# Altium schematic sheet PFC control board.SchDoc
size B; Organization: Altium Limited; Address1: L3, 12a Rodborough Rd; Address2: Frenchs Forest; Address3: NSW; Address4: Australia 2086; SheetNumber: 1; SheetTotal: 1
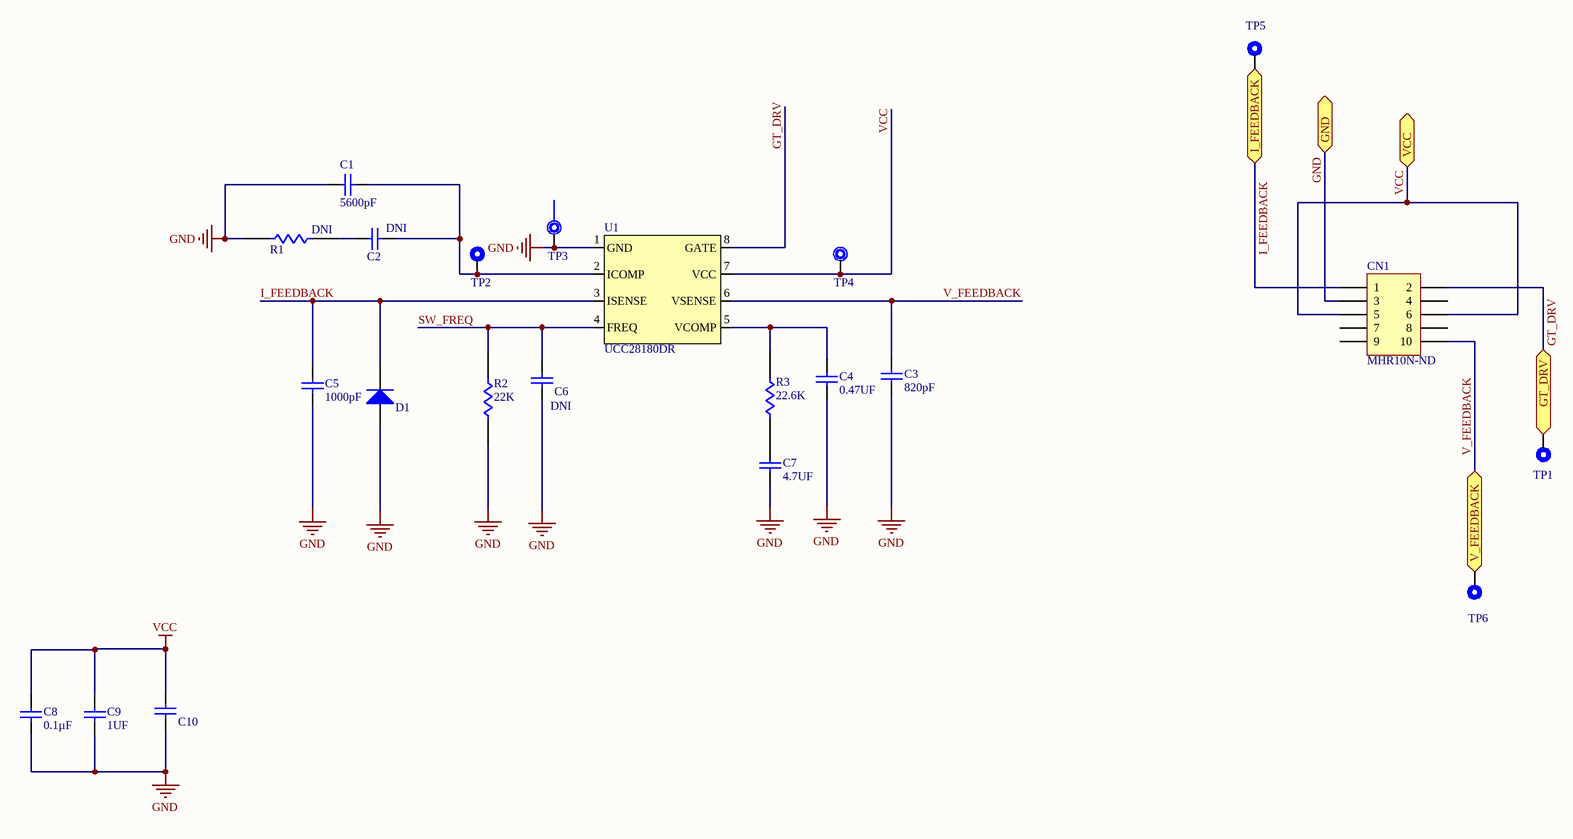
[diagram p0: PFC control board.SchDoc]

## Parts
C1  Capacitance: 5600pF  [CAP0805_NEW]  (hidden comment: GRM2195C1H562FA01D)
C2  C0805_Generic  [CAP0805_NEW]  (value not drawn)
C3  Capacitance: 820pF  [CAP0805_NEW]  (hidden comment: CC0805KRX7R9BB821)
C4  Capacitance: 0.47UF  [CAP0805_NEW]  (hidden comment: C0805C474J5RACTU)
C5  Capacitance: 1000pF  [CAP0805_NEW]  (hidden comment: C0805C102J5GACTU)
C6  C0805_Generic  [CAP0805_NEW]  (value not drawn)
C7  Capacitance: 4.7UF  [CAP0805_NEW]  (hidden comment: GRM21BR61H475KE51L)
C8  Capacitance: 0.1µF  [CAP0805_NEW]  (hidden comment: C0805C104J5RACAUTO)
C9  Capacitance: 1UF  [CAP0805_NEW]  (hidden comment: CC0805JKX7R9BB105)
C10  C0805_Generic  [CAP0805_NEW]  (value not drawn)
CN1  MHR10N-ND  [3M15452]
D1  MRA4004T3G  [MRA4004T3G]  (value not drawn)
R1  R0805_Generic  [RES0805_New]  (value not drawn)
R2  value 22K  [RES0805_New]  (hidden comment: RC0805FR-0722KL)
R3  value 22.6K  [RES0805_New]  (hidden comment: RC0805FR-0722K6L)
TP1  5006  [Test Point]  (value not drawn)
TP2  5006  [Test Point]  (value not drawn)
TP3  TP-Slot  [TP-Slot]  (value not drawn)
TP4  TP-SM  [TP-SM]  (value not drawn)
TP5  5006  [Test Point]  (value not drawn)
TP6  5006  [Test Point]  (value not drawn)
U1  UCC28180DR  [SOP127P600X175-8N]

## Ports
GND, GT_DRV, I_FEEDBACK, V_FEEDBACK, VCC

## Nets
GND: C1.1 C3.1 C4.1 C5.1 C6.1 C7.1 C8.1 C9.1 C10.1 CN1.3 D1.1 R1.2 R2.2 TP3.1 U1.1(GND) ; port GND
VCC: C8.2 C9.2 C10.2 CN1.5 CN1.6 TP4.1 U1.7(VCC) ; port VCC
GT_DRV: CN1.2 TP1.1 U1.8(GATE) ; port GT_DRV
I_FEEDBACK: C5.2 CN1.1 D1.2 TP5.1 U1.3(ISENSE) ; port I_FEEDBACK
SW_FREQ: C6.2 R2.1 U1.4(FREQ)
V_FEEDBACK: C3.2 CN1.10 TP6.1 U1.6(VSENSE) ; port V_FEEDBACK
NetC1_2: C1.2 C2.2 TP2.1 U1.2(ICOMP)
NetC2_1: C2.1 R1.1
NetC4_2: C4.2 R3.1 U1.5(VCOMP)
NetC7_2: C7.2 R3.2

Not connected (* = marked no-connect by the designer): CN1 4 7 8 9

## Notes on the sheet
- (near R1) DNI
- (near C2) DNI
- (near C6) DNI
- Title:
- Size:
- B
- Document Number:
- Revision:
- Designer:
- Approval Date:
- Start Date:
- MM/DD/YY
- --/--/--
- Sheet:
- of
- Approver:
- CONFIDENTIAL
- Project Name/Number:

## Library data of the parts
C1 = GRM2195C1H562FA01D: CAP CER 5600PF 50V C0G/NP0 0805; Manufacturer: Murata Electronics North America; Tolerance: ±1%; Temperature Coefficient: C0G, NP0; Supplier 1: Digi-Key; Manufacturer Part Number: GRM2195C1H562FA01D; RoHS: RoHS Compliant; Category: Capacitors; Stock 1: 17402; Pricing 1: 1=0.46, 10=0.323, 100=0.2124, 500=0.15736, 1000=0.13376 (USD); Packaging: Cut Tape (CT); Part Status: Active; Voltage - Rated: 50V; Operating Temperature: -55°C ~ 125°C; Features: -; Ratings: -; Applications: General Purpose; Mounting Type: Surface Mount, MLCC; Package / Case: 0805 (2012 Metric); Size / Dimension: 0.079" L x 0.049" W (2.00mm x 1.25mm); Height - Seated (Max): -; Thickness (Max): 0.037" (0.95mm); Lead Spacing: -; Lead Style: -; ComponentLink1URL: http://www.murata.com/~/media/webrenewal/support/library/catalog/products/capacitor/mlcc/c02e.pdf; ComponentLink1Description: http://www.murata.com/~/media/webrenewal/support/library/catalog/products/capacitor/mlcc/c02e.pdf; Supplier Part Number 1: 490-8299-1-ND
C3 = CC0805KRX7R9BB821: CAP CER 820PF 50V X7R 0805; Manufacturer: Yageo; Tolerance: ±10%; Supplier 1: Digi-Key; Manufacturer Part Number: CC0805KRX7R9BB821; RoHS: RoHS Compliant; Category: Capacitors; Stock 1: 41011; Pricing 1: 1=0.11, 10=0.077, 100=0.0344, 500=0.0246, 1000=0.01932 (USD); Packaging: Cut Tape (CT); Part Status: Active; Voltage - Rated: 50V; Temperature Coefficient: X7R; Operating Temperature: -55°C ~ 125°C; Features: High Voltage; Ratings: -; Applications: General Purpose; Failure Rate: -; Mounting Type: Surface Mount, MLCC; Package / Case: 0805 (2012 Metric); Size / Dimension: 0.079" L x 0.049" W (2.00mm x 1.25mm); Height - Seated (Max): -; Thickness (Max): 0.024" (0.60mm); Lead Spacing: -; Lead Style: -; ComponentLink1URL: http://www.yageo.com/documents/recent/UPY-GPHC_X7R_6.3V-to-50V_18.pdf; ComponentLink1Description: http://www.yageo.com/documents/recent/UPY-GPHC_X7R_6.3V-to-50V_18.pdf; Supplier Part Number 1: 311-1194-1-ND
C4 = C0805C474J5RACTU: CAP CER 0.47UF 50V X7R 0805; Manufacturer: KEMET; Tolerance: ±5%; Supplier 1: Digi-Key; Manufacturer Part Number: C0805C474J5RACTU; RoHS: RoHS Compliant; Category: Capacitors; Stock 1: 10142; Pricing 1: 1=0.87, 10=0.642, 100=0.4402, 500=0.3485, 1000=0.29348 (USD); Packaging: Cut Tape (CT); Part Status: Active; Voltage - Rated: 50V; Temperature Coefficient: X7R; Operating Temperature: -55°C ~ 125°C; Features: Low ESL; Ratings: -; Applications: General Purpose; Failure Rate: -; Mounting Type: Surface Mount, MLCC; Package / Case: 0805 (2012 Metric); Size / Dimension: 0.079" L x 0.049" W (2.00mm x 1.25mm); Height - Seated (Max): -; Thickness (Max): 0.043" (1.10mm); Lead Spacing: -; Lead Style: -; ComponentLink1URL: http://www.kemet.com/docfinder?Partnumber=C0805C474J5RACTU; ComponentLink1Description: http://www.kemet.com/docfinder?Partnumber=C0805C474J5RACTU; Supplier Part Number 1: 399-11174-1-ND
C5 = C0805C102J5GACTU: CAP CER 1000PF 50V C0G/NP0 0805; Manufacturer: KEMET; Tolerance: ±5%; Temperature Coefficient: C0G, NP0; Supplier 1: Digi-Key; Manufacturer Part Number: C0805C102J5GACTU; RoHS: RoHS Compliant; Category: Capacitors; Stock 1: 297579; Pricing 1: 1=0.12, 10=0.09, 100=0.0403, 500=0.02876, 1000=0.0226 (USD); Packaging: Cut Tape (CT); Part Status: Active; Voltage - Rated: 50V; Operating Temperature: -55°C ~ 125°C; Features: Low ESL; Ratings: -; Applications: General Purpose; Failure Rate: -; Mounting Type: Surface Mount, MLCC; Package / Case: 0805 (2012 Metric); Size / Dimension: 0.079" L x 0.049" W (2.00mm x 1.25mm); Height - Seated (Max): -; Thickness (Max): 0.035" (0.88mm); Lead Spacing: -; Lead Style: -; ComponentLink1URL: http://www.kemet.com/docfinder?Partnumber=C0805C102J5GACTU; ComponentLink1Description: http://www.kemet.com/docfinder?Partnumber=C0805C102J5GACTU; Supplier Part Number 1: 399-1136-1-ND
C7 = GRM21BR61H475KE51L: CAP CER 4.7UF 50V X5R 0805; Manufacturer: Murata Electronics North America; Tolerance: ±10%; Supplier 1: Digi-Key; Manufacturer Part Number: GRM21BR61H475KE51L; RoHS: RoHS Compliant; Category: Capacitors; Stock 1: 103228; Pricing 1: 1=0.35, 10=0.242, 100=0.145, 500=0.10872, 1000=0.09181 (USD); Packaging: Cut Tape (CT); Part Status: Active; Voltage - Rated: 50V; Temperature Coefficient: X5R; Operating Temperature: -55°C ~ 85°C; Features: -; Ratings: -; Applications: General Purpose; Mounting Type: Surface Mount, MLCC; Package / Case: 0805 (2012 Metric); Size / Dimension: 0.079" L x 0.049" W (2.00mm x 1.25mm); Height - Seated (Max): -; Thickness (Max): 0.055" (1.40mm); Lead Spacing: -; Lead Style: -; ComponentLink1URL: http://search.murata.co.jp/Ceramy/image/img/A01X/G101/ENG/GRM21BR61H475KE51-01.pdf; ComponentLink1Description: http://search.murata.co.jp/Ceramy/image/img/A01X/G101/ENG/GRM21BR61H475KE51-01.pdf; Supplier Part Number 1: 490-10751-1-ND
C8 = C0805C104J5RACAUTO: CAP CER 0.1UF 50V X7R 0805; Manufacturer: KEMET; Tolerance: ±5%; Supplier 1: Digi-Key; Manufacturer Part Number: C0805C104J5RACAUTO; RoHS: RoHS Compliant; Category: Capacitors; Stock 1: 8605; Pricing 1: 1=0.22, 10=0.152, 100=0.0769, 500=0.05262, 1000=0.04655 (USD); Packaging: Cut Tape (CT); Part Status: Active; Voltage - Rated: 50V; Temperature Coefficient: X7R; Operating Temperature: -55°C ~ 125°C; Features: -; Ratings: AEC-Q200; Applications: Automotive; Failure Rate: -; Mounting Type: Surface Mount, MLCC; Package / Case: 0805 (2012 Metric); Size / Dimension: 0.079" L x 0.049" W (2.00mm x 1.25mm); Height - Seated (Max): -; Thickness (Max): 0.035" (0.88mm); Lead Spacing: -; Lead Style: -; ComponentLink1URL: http://www.kemet.com/docfinder?Partnumber=C0805C104J5RACAUTO; ComponentLink1Description: http://www.kemet.com/docfinder?Partnumber=C0805C104J5RACAUTO; Supplier Part Number 1: 399-6925-1-ND
C9 = CC0805JKX7R9BB105: CAP CER 1UF 50V X7R 0805; Manufacturer: Yageo; Tolerance: ±5%; Supplier 1: Digi-Key; Manufacturer Part Number: CC0805JKX7R9BB105; RoHS: RoHS Compliant; Category: Capacitors; Stock 1: 1863; Pricing 1: 1=0.34, 10=0.231, 100=0.131, 500=0.09248, 1000=0.08093 (USD); Packaging: Cut Tape (CT); Part Status: Active; Voltage - Rated: 50V; Temperature Coefficient: X7R; Operating Temperature: -55°C ~ 125°C; Features: -; Ratings: -; Applications: General Purpose; Failure Rate: -; Mounting Type: Surface Mount, MLCC; Package / Case: 0805 (2012 Metric); Size / Dimension: 0.079" L x 0.049" W (2.00mm x 1.25mm); Height - Seated (Max): -; Thickness (Max): 0.057" (1.45mm); Lead Spacing: -; Lead Style: -; ComponentLink1URL: http://www.yageo.com/documents/recent/UPY-GPHC_X7R_6.3V-to-50V_18.pdf; ComponentLink1Description: http://www.yageo.com/documents/recent/UPY-GPHC_X7R_6.3V-to-50V_18.pdf; Supplier Part Number 1: 311-3498-1-ND
CN1 = MHR10N-ND: CONN HEADER 10PS R/A LONG LATCH; Manufacturer: 3M; Manufacturer Part Number: N3793-5302RB; Pitch - Mating: 0.100" (2.54mm); Style: Board to Board or Cable; Shrouding: Shrouded - 4 Wall; Number of Positions: 10; Number of Positions Loaded: All; Contact Length - Mating: 0.240" (6.10mm); Contact Length - Post: 0.112" (2.84mm); Material Flammability Rating: UL94 V-0; Current Rating: 1.75A; Supplier 1: Digi-Key; RoHS: RoHS Compliant; Category: Connectors, Interconnects; Stock 1: 2811; Pricing 1: 1=1.86, 10=1.691, 100=1.449, 500=1.2075, 1000=1.035, 5000=0.9177, 10000=0.897 (USD); Packaging: Bulk; Part Status: Active; Connector Type: Header; Contact Type: Male Pin; Number of Rows: 2; Row Spacing - Mating: 0.100" (2.54mm); Mounting Type: Through Hole, Right Angle; Termination: Solder; Fastening Type: Latch Lock/Eject Hooks, Long; Overall Contact Length: -; Insulation Height: 0.340" (8.64mm); Contact Shape: Square; Contact Finish - Mating: Gold; Contact Finish Thickness - Mating: 30µin (0.76µm); Contact Finish - Post: Tin; Contact Material: Copper Alloy; Insulation Material: Polycyclohexylenedimethylene Terephthalate (PCT), Polyester, Glass Filled; Features: Keying Slot, Mounting Flange; Operating Temperature: -55°C ~ 105°C; Ingress Protection: -; Insulation Color: Black; Voltage Rating: -; Mated Stacking Heights: -; Contact Finish Thickness - Post: 200µin (5.08µm); Applications: -; ComponentLink1URL: http://multimedia.3m.com/mws/media/22448O/3m-four-wall-header-3000-series-100-x-100-ts-0772.pdf; ComponentLink1Description: http://multimedia.3m.com/mws/media/22448O/3m-four-wall-header-3000-series-100-x-100-ts-0772.pdf; Supplier Part Number 1: MHR10N-ND
R2 = RC0805FR-0722KL: RES SMD 22K OHM 1% 1/8W 0805; Manufacturer: Yageo; Power (Watts): 0.125W, 1/8W; Temperature Coefficient: ±100ppm/°C; Supplier 1: Digi-Key; Manufacturer Part Number: RC0805FR-0722KL; RoHS: RoHS Compliant; Category: Resistors; Stock 1: 1085000; Pricing 1: 5000=0.00284, 10000=0.00247, 25000=0.00217, 50000=0.00199, 125000=0.00195 (USD); Packaging: Tape & Reel (TR); Part Status: Active; Tolerance: ±1%; Composition: Thick Film; Features: Moisture Resistant; Operating Temperature: -55°C ~ 155°C; Package / Case: 0805 (2012 Metric); Supplier Device Package: 0805; Size / Dimension: 0.079" L x 0.049" W (2.00mm x 1.25mm); Height - Seated (Max): 0.024" (0.60mm); Failure Rate: -; ComponentLink1URL: http://www.yageo.com/documents/recent/PYu-RC_Group_51_RoHS_L_7.pdf; ComponentLink1Description: http://www.yageo.com/documents/recent/PYu-RC_Group_51_RoHS_L_7.pdf; Supplier Part Number 1: 311-22.0KCRTR-ND
R3 = RC0805FR-0722K6L: RES SMD 22.6K OHM 1% 1/8W 0805; Manufacturer: Yageo; Power (Watts): 0.125W, 1/8W; Temperature Coefficient: ±100ppm/°C; Supplier 1: Digi-Key; Manufacturer Part Number: RC0805FR-0722K6L; RoHS: RoHS Compliant; Category: Resistors; Stock 1: 45000; Pricing 1: 5000=0.00284, 10000=0.00247, 25000=0.00217, 50000=0.00199, 125000=0.00195 (USD); Packaging: Tape & Reel (TR); Part Status: Active; Tolerance: ±1%; Composition: Thick Film; Features: Moisture Resistant; Operating Temperature: -55°C ~ 155°C; Package / Case: 0805 (2012 Metric); Supplier Device Package: 0805; Size / Dimension: 0.079" L x 0.049" W (2.00mm x 1.25mm); Height - Seated (Max): 0.024" (0.60mm); Failure Rate: -; ComponentLink1URL: http://www.yageo.com/documents/recent/PYu-RC_Group_51_RoHS_L_7.pdf; ComponentLink1Description: http://www.yageo.com/documents/recent/PYu-RC_Group_51_RoHS_L_7.pdf; Supplier Part Number 1: 311-22.6KCRTR-ND
TP1 TP2 TP5 TP6 = 5006: TEST POINT PC COMPACT .063"D BLK; Manufacturer 1: Keystone Electronics; Category 1: Test and Measurement; Plating: Silver; Material - Insulation: Nylon 46, UL 94V-0; Material - Body: Phosphor Bronze; Supplier 1: Digi-Key; Supplier Part Number 1: 36-5006-ND; Manufacturer Part Number 1: 5006; RoHS 1: RoHS Compliant; Description 1: TEST POINT PC COMPACT .063"D BLK; Stock 1: 199444; Pricing 1: 1=0.37, 10=0.316, 50=0.2298, 100=0.2209, 250=0.19832, 500=0.18932, 1000=0.1616, 2500=0.14424, 5000=0.13523 (USD); Packaging: Bulk; Part Status: Active; Type: PC Test Point, Compact; Mounting Type: 0.063" (1.60mm) Hole Diameter; Color: Black; Size / Dimension: 0.125" Dia x 0.220" L (3.18mm x 5.59mm); ComponentLink1URL: http://www.keyelco.com/product-pdf.cfm?p=1314; ComponentLink1Description: http://www.keyelco.com/product-pdf.cfm?p=1314
U1 = UCC28180DR: IC PFC CTRLR AVERAGE CURR 8SOIC; Manufacturer 1: Texas Instruments; Category 1: Integrated Circuits (ICs); Mode: Continuous Conduction (CCM); Frequency - Switching: 18kHz ~ 250kHz; Current - Startup: 75µA; Voltage - Supply: 21V; Supplier 1: Digi-Key; Supplier Part Number 1: 296-44502-2-ND; Manufacturer Part Number 1: UCC28180DR; RoHS 1: RoHS Compliant; Description 1: IC PFC CTRLR AVERAGE CURR 8SOIC; Stock 1: 5000; Pricing 1: 2500=0.50625 (USD); Packaging: Tape & Reel (TR); Part Status: Active; Operating Temperature: -40°C ~ 125°C; Mounting Type: Surface Mount; Package / Case: 8-SOIC (0.154", 3.90mm Width); Supplier Device Package: 8-SOIC; ComponentLink1URL: http://www.ti.com/lit/ds/symlink/ucc28180.pdf; ComponentLink1Description: http://www.ti.com/lit/ds/symlink/ucc28180.pdf